# EAGLE design controller6 (EAGLE 7.7.0)

## Sheet 1 of 2
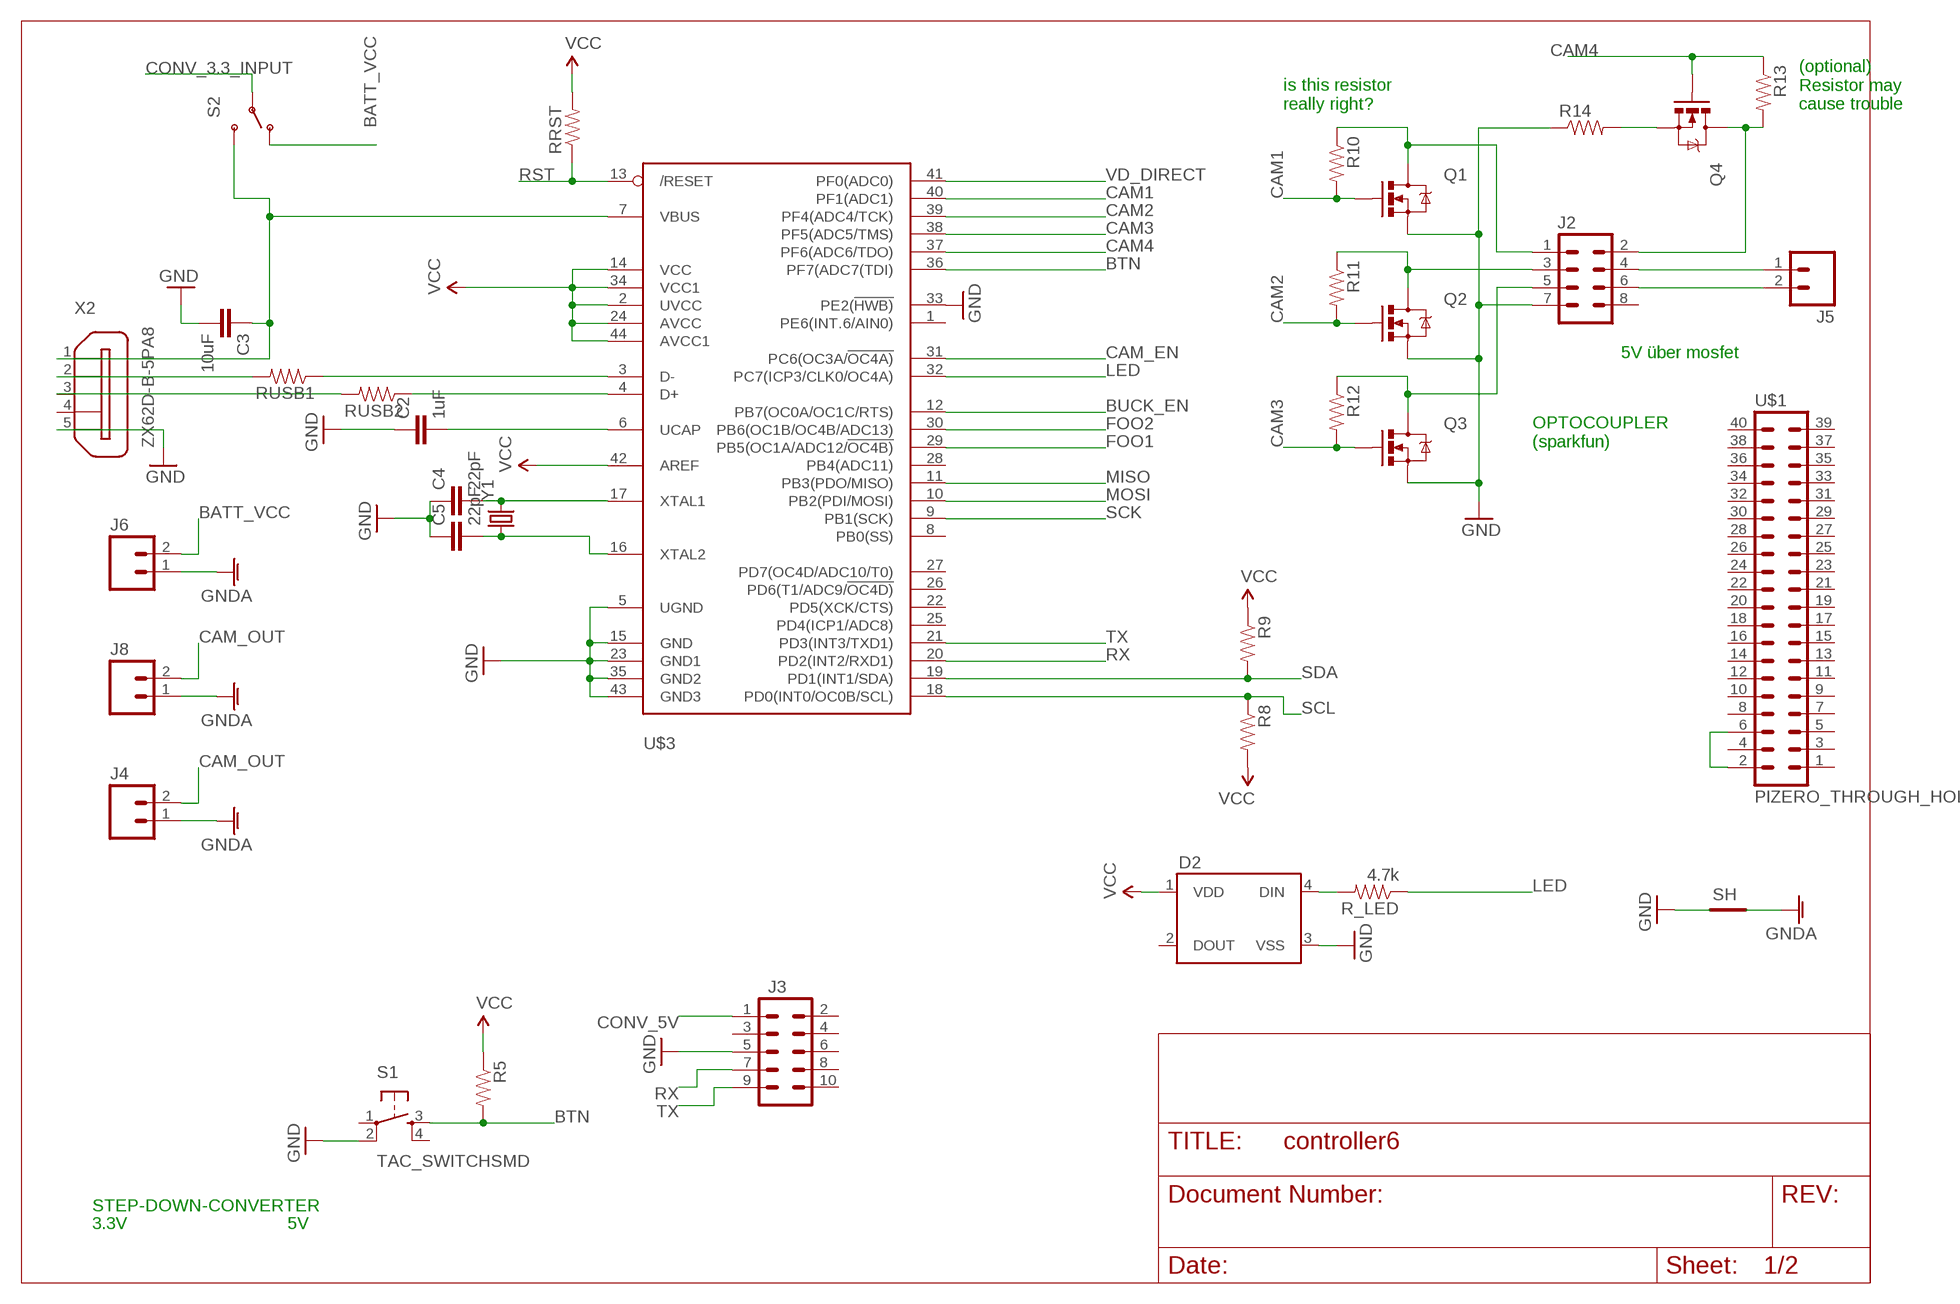
[diagram p0: schematic, sheet 1]

### Parts
C2  1uF  CAP1206  [1206]
C3  10uF  CAP0805  [0805]
C4  22pF  CAP0805  [0805]
C5  22pF  CAP0805  [0805]
D2  WS2812B  [WS2812B]
J2  M04X2  [2X4]
J3  M05X2NO_SILK  [2X5_NOSILK]
J4  M02LOCK  [1X02_LOCK]
J5  M02PTH  [1X02]
J6  M02LOCK  [1X02_LOCK]
J8  M02LOCK  [1X02_LOCK]
Q1  MOSFET-NCHANNELBSS138  [SOT23-3]
Q2  MOSFET-NCHANNELBSS138  [SOT23-3]
Q3  MOSFET-NCHANNELBSS138  [SOT23-3]
Q4  MOSFET-NCHANNELBSS138  [SOT23-3]
R5  RESISTOR0805-RES  [0805]
R8  RESISTOR0805-RES  [0805]
R9  RESISTOR0805-RES  [0805]
R10  RESISTOR0805-RES  [0805]
R11  RESISTOR0805-RES  [0805]
R12  RESISTOR0805-RES  [0805]
R13  RESISTOR0805-RES  [0805]
R14  RESISTOR0805-RES  [0805]
R_LED  4.7k  RESISTOR0805-RES  [0805]
RRST  RESISTOR0805-RES  [0805]
RUSB1  RESISTOR0805-RES  [0805]
RUSB2  RESISTOR0805-RES  [0805]
S1  TAC_SWITCHSMD  [TACTILE-SWITCH-SMD]
S2  SWITCH-SPDTPTH_LOCK  [SWITCH-SPDT_LOCK.007S]
SH  SHORT-HT5  [SHORT_TOP-50]
U$1  PIZERO_THROUGH_HOLE  [PIZERO_THOUGH_HOLE]
U$3  ATMEGA32U4-AU  [TQFP44]
X2  ZX62D-B-5PA8  [ZX62D-B-5PA8]
Y1  CRYSTALCRYSTAL-SMD-5X3-16MHZ  [CRYSTAL-SMD-5X3]

### Nets
BATT_VCC [camera_power]: J6.2 S2.1(O) ; also sheet 2
BTN: R5.2 S1.3 U$3.36(PF7(ADC7(TDI))
BUCK_EN: U$3.12(PB7(OC0A/OC1C/RTS)) ; also sheet 2
CAM1: Q1.1(G) R10.2 U$3.40(PF1(ADC1))
CAM2: Q2.1(G) R11.2 U$3.39(PF4(ADC4/TCK))
CAM3: Q3.1(G) R12.2 U$3.38(PF5(ADC5/TMS))
CAM4: Q4.1(G) R13.1 U$3.37(PF6(ADC6/TDO))
CAM_EN: U$3.31(PC6(OC3A/!OC4A))
CAM_OUT [camera_power]: J4.2 J8.2
CONV_3.3_INPUT [camera_power]: S2.2(P) ; also sheet 2
CONV_5V [power]: J3.1 ; also sheet 2
FOO1: U$3.29(PB5(OC1A/ADC12/!OC4B))
FOO2: U$3.30(PB6(OC1B/OC4B/ADC13))
GND [power]: C2.1 C3.2 C4.1 C5.1 D2.3(VSS) J2.7 J3.5 Q1.2(S) Q2.2(S) Q3.2(S) R14.1 S1.2 SH.1 U$3.5(UGND) U$3.15(GND) U$3.23(GND1) U$3.33(PE2(!HWB)) U$3.35(GND2) U$3.43(GND3) X2.5 ; also sheet 2
GNDA [camera_power]: J4.1 J6.1 J8.1 SH.2
LED: R_LED.1 U$3.32(PC7(ICP3/CLK0/OC4A))
MISO: U$3.11(PB3(PDO/MISO)) ; also sheet 2
MOSI: U$3.10(PB2(PDI/MOSI)) ; also sheet 2
N$1: J2.4 J5.1
N$4: RUSB1.1 U$3.3(D-)
N$5: RUSB2.1 U$3.4(D+)
N$6: J2.6 J5.2
N$7: D2.4(DIN) R_LED.2
N$8: C4.2 U$3.17(XTAL1) Y1.3
N$9: C5.2 U$3.16(XTAL2) Y1.1
N$10: RUSB1.2 X2.2
N$11: RUSB2.2 X2.3
N$16: J2.2 Q4.3(D) R13.2
N$18: Q4.2(S) R14.2
N$19: U$1.2 U$1.6
N$20: C2.2 U$3.6(UCAP)
N$22: C3.1 S2.3(S) U$3.7(VBUS) X2.1
N$31: J2.1 Q1.3(D) R10.1
N$32: J2.3 Q2.3(D) R11.1
N$33: J2.5 Q3.3(D) R12.1
RST: RRST.1 U$3.13(/RESET) ; also sheet 2
RX: J3.7 U$3.20(PD2(INT2/RXD1))
SCK: U$3.9(PB1(SCK)) ; also sheet 2
SCL: R8.1 U$3.18(PD0(INT0/OC0B/SCL)) ; also sheet 2
SDA: R9.2 U$3.19(PD1(INT1/SDA)) ; also sheet 2
TX: J3.9 U$3.21(PD3(INT3/TXD1))
VCC [power]: D2.1(VDD) R5.1 R8.2 R9.1 RRST.2 U$3.2(UVCC) U$3.14(VCC) U$3.24(AVCC) U$3.34(VCC1) U$3.42(AREF) U$3.44(AVCC1) ; also sheet 2
VD_DIRECT: U$3.41(PF0(ADC0)) ; also sheet 2
Unconnected: D2.2(DOUT) J2.8 J3.2 J3.3 J3.4 J3.6 J3.8 J3.10 S1.1 S1.4 U$1.1 U$1.3 U$1.4 U$1.5 U$1.7 U$1.8 U$1.9 U$1.10 U$1.11 U$1.12 U$1.13 U$1.14 U$1.15 U$1.16 U$1.17 U$1.18 U$1.19 U$1.20 U$1.21 U$1.22 U$1.23 U$1.24 U$1.25 U$1.26 U$1.27 U$1.28 U$1.29 U$1.30 U$1.31 U$1.32 U$1.33 U$1.34 U$1.35 U$1.36 U$1.37 U$1.38 U$1.39 U$1.40 U$3.1(PE6(INT.6/AIN0)) U$3.8(PB0(SS)) U$3.22(PD5(XCK/CTS)) U$3.25(PD4(ICP1/ADC8)) U$3.26(PD6(T1/ADC9/!OC4D)) U$3.27(PD7(OC4D/ADC10/T0)) U$3.28(PB4(ADC11)) X2.4 X2.S1 X2.S2 X2.S3 X2.S4

### Notes on the sheet
- is this resistor
  really right?
- (optional)
  Resistor may 
  cause trouble
- 5V über mosfet
- OPTOCOUPLER
  (sparkfun)
- STEP-DOWN-CONVERTER
- 3.3V | 5V

## Sheet 2 of 2
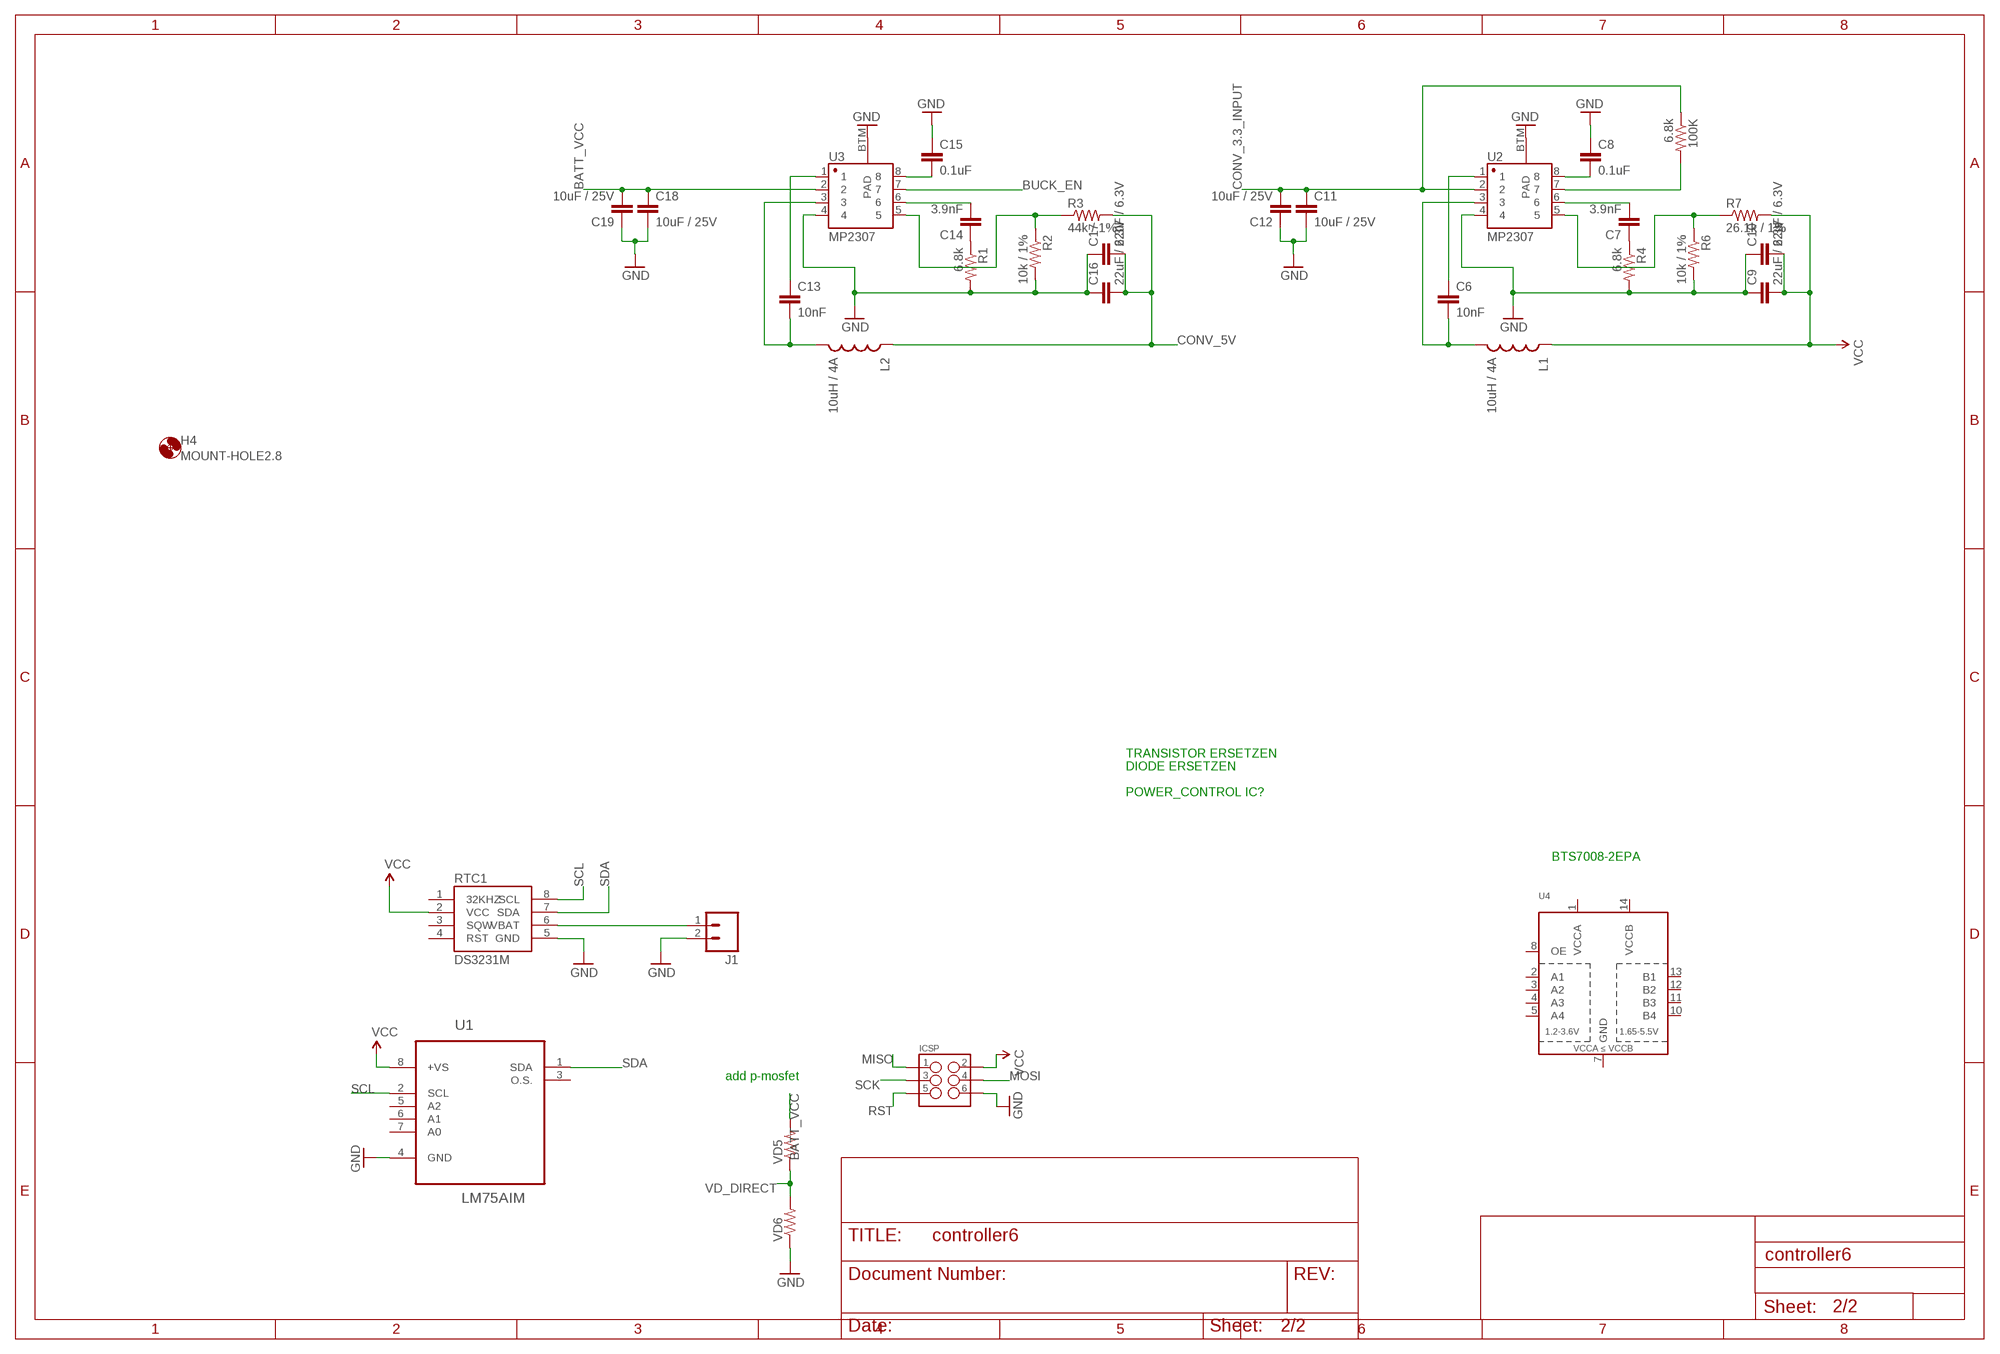
[diagram p1: schematic, sheet 2]

### Parts
100K  6.8k  RESISTOR0805-RES  [0805]
C6  10nF  CAP1206  [1206]
C7  3.9nF  CAP0805  [0805]
C8  0.1uF  CAP0805  [0805]
C9  22uF / 6.3V  CAP1206  [1206]
C10  22uF / 6.3V  CAP1206  [1206]
C11  10uF / 25V  CAP1206  [1206]
C12  10uF / 25V  CAP1206  [1206]
C13  10nF  CAP1206  [1206]
C14  3.9nF  CAP0805  [0805]
C15  0.1uF  CAP0805  [0805]
C16  22uF / 6.3V  CAP1206  [1206]
C17  22uF / 6.3V  CAP1206  [1206]
C18  10uF / 25V  CAP1206  [1206]
C19  10uF / 25V  CAP1206  [1206]
H4  MOUNT-HOLE2.8  [2,8]
ICSP  M03X2FEMALE  [2X3]
J1  M02LOCK_LONGPADS  [1X02_LOCK_LONGPADS]
L1  10uH / 4A  INDUCTORSDR0403-560KL  [SDR0403]
L2  10uH / 4A  INDUCTORSDR0403-560KL  [SDR0403]
R1  6.8k  RESISTOR0805-RES  [0805]
R2  10k / 1%  RESISTOR0805-RES  [0805]
R3  44k / 1%  RESISTOR0805-RES  [0805]
R4  6.8k  RESISTOR0805-RES  [0805]
R6  10k / 1%  RESISTOR0805-RES  [0805]
R7  26.1k / 1%  RESISTOR0805-RES  [0805]
RTC1  DS3231M  [SOIC8]
U1  LM75AIM  [SOIC127P620X175-8N]
U2  MP2307  GENERIC-SOIC8MSGEQ7N-FILTER  [SO08]
U3  MP2307  GENERIC-SOIC8MSGEQ7N-FILTER  [SO08]
U4  TXB0104PWRSOIC14  [SO14]
VD5  RESISTOR1206  [1206]
VD6  RESISTOR1206  [1206]

### Nets
BATT_VCC [camera_power]: C18.1 C19.2 U3.2 VD5.2 ; also sheet 1
BUCK_EN: U3.7 ; also sheet 1
CONV_3.3_INPUT [camera_power]: 100K.1 C11.1 C12.2 U2.2 ; also sheet 1
CONV_5V [power]: C16.2 C17.2 L2.P$1 R3.2 ; also sheet 1
GND [power]: C8.1 C9.1 C10.1 C11.2 C12.1 C15.1 C16.1 C17.1 C18.2 C19.1 ICSP.6 J1.2 R1.2 R2.2 R4.2 R6.2 RTC1.5(GND) U1.4(GND) U2.4 U2.BTM(PAD) U3.4 U3.BTM(PAD) VD6.1 ; also sheet 1
MISO: ICSP.1 ; also sheet 1
MOSI: ICSP.4 ; also sheet 1
N$2: 100K.2 U2.7
N$3: C6.1 U2.1
N$14: C8.2 U2.8
N$17: C6.2 L1.P$2 U2.3
N$21: C7.1 R4.1
N$23: C7.2 U2.6
N$24: R6.1 R7.1 U2.5
N$25: C15.2 U3.8
N$26: C13.2 L2.P$2 U3.3
N$27: C13.1 U3.1
N$28: C14.1 R1.1
N$29: C14.2 U3.6
N$30: R2.1 R3.1 U3.5
RST: ICSP.5 ; also sheet 1
SCK: ICSP.3 ; also sheet 1
SCL: RTC1.8(SCL) U1.2(SCL) ; also sheet 1
SDA: RTC1.7(SDA) U1.1(SDA) ; also sheet 1
VBAT: J1.1 RTC1.6(VBAT)
VCC [power]: C9.2 C10.2 ICSP.2 L1.P$1 R7.2 RTC1.2(VCC) U1.8(+VS) ; also sheet 1
VD_DIRECT: VD5.1 VD6.2 ; also sheet 1
Unconnected: RTC1.1(32KHZ) RTC1.3(SQW) RTC1.4(RST) U1.3(O.S.) U1.5(A2) U1.6(A1) U1.7(A0) U4.1(VCCA) U4.2(A1) U4.3(A2) U4.4(A3) U4.5(A4) U4.7(GND) U4.8(OE) U4.10(B4) U4.11(B3) U4.12(B2) U4.13(B1) U4.14(VCCB)

### Notes on the sheet
- TRANSISTOR ERSETZEN
- DIODE ERSETZEN
- POWER_CONTROL IC?
- BTS7008-2EPA
- add p-mosfet

## Library data of the parts
100K R1-R4 R6 R7 R_LED = SparkFun-Resistors:RESISTOR: Resistor Basic schematic elements and footprints for 0603, 1206, and PTH resistors.
C2 C6-C19 = SparkFun-Capacitors:CAP: Capacitor Standard 0603 ceramic capacitor, and 0.1" leaded capacitor.
C3-C5 = SparkFun-Passives:CAP: Capacitor Standard 0603 ceramic capacitor, and 0.1" leaded capacitor.
D2 = SparkFun-LED:WS2812B: WS2812B - Intelligent control LED integrated light source Technical Specifications: Power Supply Voltage (VDD): 3.5 to 5.3 V Input Voltage (VI): -0.5 to VDD+0.5 V Operating Junction Temperature (Topt): -25°C to +80°C Storage Temperature Range (Tstg): -55°C to +150°C; PROD_ID: DIO-12503
H4 = holes:MOUNT-HOLE: MOUNTING HOLE with drill center marker
ICSP = SparkFun-Connectors:M03X2: 2x3 .1" header. Shrouded, with keying- CONN-10681 SMT- CONN-11415 Pogo pins- HW-11044; PROD_ID: CONN-11566; VALUE: FEMALE 2x3
J1 J4-J6 J8 = SparkFun-Connectors:M02: Standard 2-pin 0.1" header. Use with - straight break away headers ( PRT-00116) - right angle break away headers (PRT-00553) - swiss pins (PRT-00743) - machine pins (PRT-00117) - female headers (PRT-00115) Molex polarized connector foot print use with: PRT-08233 with associated crimp pins and housings. 2.54_SCREWTERM for use with PRT-10571. 3.5mm Screw Terminal footprints for PRT-08084 5mm Screw Terminal footprints for use with PRT-08432
J2 = SparkFun-Connectors:M04X2: .1" header, two rows of four.
J3 = SparkFun-Connectors:M05X2: Header 5x2 Standard 10-pin dual row 0.1" header. Commonly used with AVR-ISP. Use with Spark Fun Electronics SKU: PRT-00778
L1 L2 = SparkFun-Passives:INDUCTOR: Inductors Basic Inductor/Choke - 0603 and 1206. Footprints are not proven and vary greatly between part numbers. INDUCTOR POWER 3.3UH 4.0A SMD 0.197" L x 0.197" W x 0.177" H (5.00mm x 5.00mm x 4.50mm); DIST: DIGIKEY; DIST_ID: SDR0403-560KLCT-ND; VALUE: 56uH
Q1-Q4 = SparkFun-DiscreteSemi:MOSFET-NCHANNEL: Common NMOSFET Parts MFG P/N Store ID Prod ID FDD8780 TRANS-09984 SI7820DN TRANS-11055 FDS6630A IC-08089 2N7002PW TRANS-11151 FQP30N06L COM-10213 TRANS-10060 BSS123LT1G TRANS-08345 BSS138 TRANS-00830 BS170 2N7000; PROD_ID: TRANS-00830; VALUE: 200mA/50V
R5 R8-R14 RRST RUSB1 RUSB2 VD5 VD6 = SparkFun-Passives:RESISTOR: Resistor Basic schematic elements and footprints for 0603, 1206, and PTH resistors.
RTC1 = SparkFun-DigitalIC:DS3231M: DS3231M Real Time Clock. Accuracy +/-5ppm. Battery Backup. 2.3V to 5.5V.; PROD_ID: IC-11985
S1 = SparkFun-Retired:TAC_SWITCH: Momentary Switch Button commonly used for reset or general input. Spark Fun Electronics SKU : COM-00097 SMT- SWCH-08247; PROD_ID: SWCH-08247
S2 = SparkFun-Electromechanical:SWITCH-SPDT: SPDT Switch Simple slide switch, Spark Fun Electronics SKU : COM-00102 DPDT SMT slide switch, AYZ0202, SWCH-08179
SH = shorts-old:SHORT-H: Short between two nets; BOM: no
U1 = NSC_By_element14_Batch_1.1:LM75AIM: Digital Temperature Sensor; MPN: LM75AIM; OC_FARNELL: 1699380; OC_NEWARK: -; PACKAGE: SOIC-8; SUPPLIER: NATIONAL SEMICONDUCTOR
U2 U3 = SparkFun-AnalogIC:GENERIC-SOIC8: A placeholder for generic narrow & wide SOIC8 foorptints - used on the DIP adapter board.; PROD_ID: IC-10141
U4 = SparkFun-DigitalIC:TXB0104PWR: 4-Bit Bi-Directional Level Shifter 1.2V-3.6V (VCCA) to 1.65V-5.5V (VCCB) bi-directional level shifter with auto direction sensing. Max data rate - VCCA 1.8V: 20Mbps (50ns), VCCA 3.3V: 100Mbps (10ns) Digikey: 296-21929-1-ND (TSSOP) IC-11329; PROD_ID: IC-11329
U$1 = pizero:PIZERO_THROUGH_HOLE
U$3 = adafruit:ATMEGA32U4: http://www.ladyada.net/library/eagle
X2 = zx62d-b-5pa8-oshpark_10:ZX62D-B-5PA8: Micro USB Type B Connector - Standard, Shell Through Hole Source: http://www.hirose.co.jp/cataloge_hp/ed_ZX_20140804.pdf; MF: Hirose; MPN: ZX62D-B-5PA8; OC_FARNELL: 2300438; OC_NEWARK: 69W0712
Y1 = SparkFun-FreqCtrl:CRYSTAL: Various standard crystals. Proven footprints.; PROD_ID: XTAL-08218

## Net classes
0 default: width 0.254 mm, clearance 0.254 mm
1 power: width 0.305 mm, clearance 0.254 mm
2 camera_power: width 0.508 mm, clearance 0.254 mm
3 usbsignal: width 0.305 mm, clearance 0.254 mm

## Board
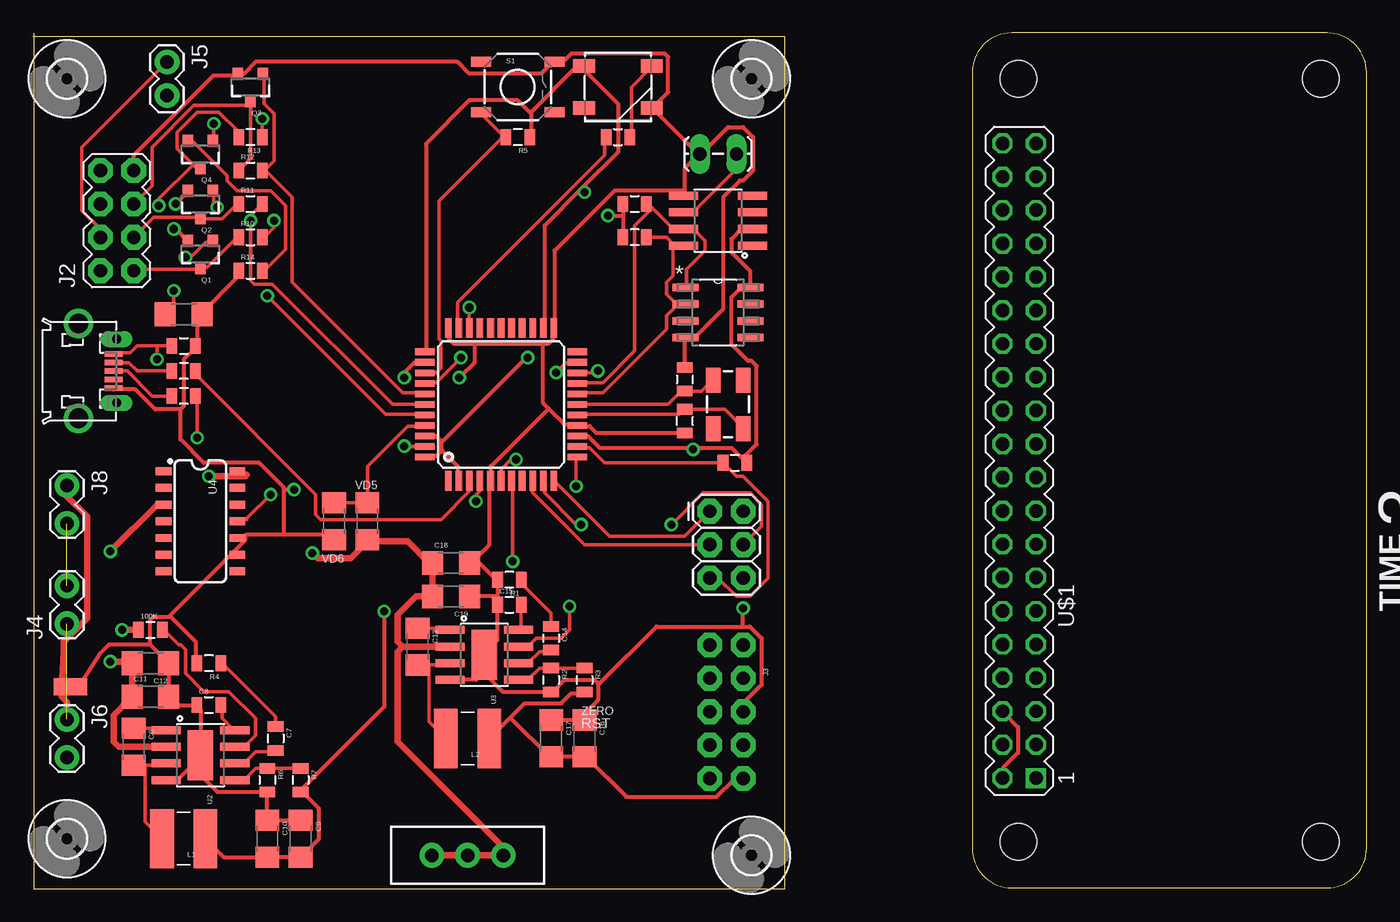
[diagram p2: board, top side]
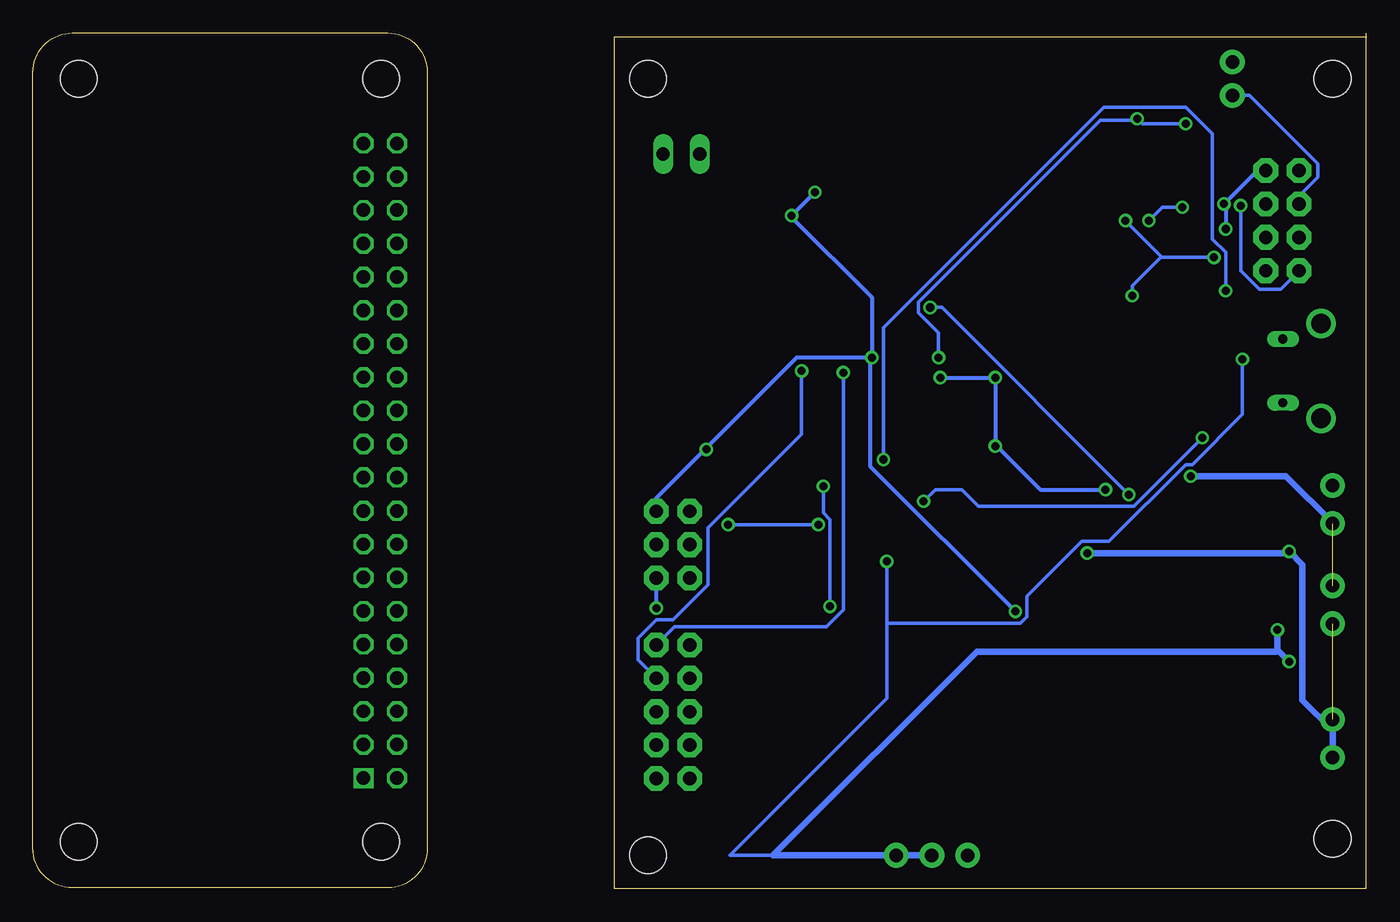
[diagram p3: board, bottom side, seen from below]

Size 101.45 x 65.08 mm. Coordinates in mm from the lower left corner, seen from the top.
Outline: 0,64.77 57.2,64.77 57.2,0.01 0.05,0 0.05,65.03
Copper layers (1*16): Top 0.035mm / dielectric 1.5mm / Bottom 0.035mm
Design rules "default": minimum track width 10mil, minimum drill 24mil, track to track 8mil, track to pad 8mil, pad to pad 8mil, via to via 8mil, smd to smd 8mil, copper to edge 40mil, drill to drill 8mil, minimum pad ring 10mil, minimum via ring 8mil, stop-mask expansion 4mil, vias tented up to drill 0mil, thermal gap 10mil

### Footprints (pad centres in the part's own frame; a part is rotated, then mirrored left to right if it is on the bottom)
0805 = smd 0.8 x 1.2: 1 -0.9,0; 2 0.9,0
1206 = smd 1.6 x 1.8: 1 -1.4,0; 2 1.4,0
WS2812B = smd 1.651 x 1: 1 -2.577,1.6; 2 -2.577,-1.6; 3 2.577,-1.6; 4 2.577,1.6
2,8 = hole 2.8: 0,0
2X3 = drill 1.016 pad 1.88 octagon: 1 0,0; 2 0,2.54; 3 2.54,0; 4 2.54,2.54; 5 5.08,0; 6 5.08,2.54
1X02_LOCK_LONGPADS = drill 1.016 long: 1 -0.127,0; 2 2.667,0
2X4 = drill 1.016 pad 1.88 octagon: 1 -3.81,-1.27; 2 -3.81,1.27; 3 -1.27,-1.27; 4 -1.27,1.27; 5 1.27,-1.27; 6 1.27,1.27; 7 3.81,-1.27; 8 3.81,1.27
2X5_NOSILK = drill 1.016 pad 1.88 octagon: 1 -1.27,5.08; 2 1.27,5.08; 3 -1.27,2.54; 4 1.27,2.54; 5 -1.27,0; 6 1.27,0; 7 -1.27,-2.54; 8 1.27,-2.54; 9 -1.27,-5.08; 10 1.27,-5.08
1X02_LOCK = drill 1.016 pad 1.88: 1 -0.178,0; 2 2.718,0
1X02 = drill 1.016 pad 1.88: 1 0,0; 2 2.54,0
SDR0403 = smd 1.8 x 4.5: P$1 -1.65,0; P$2 1.65,0
SOT23-3 = smd 0.8 x 0.9: 1 -0.95,-1; 2 0.95,-1; 3 0,1.1
SOIC8 = smd 0.61 x 2.21: 1 -1.905,-2.616; 2 -0.635,-2.616; 3 0.635,-2.616; 4 1.905,-2.616; 5 1.905,2.616; 6 0.635,2.616; 7 -0.635,2.616; 8 -1.905,2.616
TACTILE-SWITCH-SMD = smd 1.524 x 0.762: 1 -2.794,1.905; 2 2.794,1.905; 3 -2.794,-1.905; 4 2.794,-1.905
SWITCH-SPDT_LOCK.007S = drill 1.016 pad 1.88: 1 0,2.718; 2 0,0; 3 0,-2.718
SHORT_TOP-50 = smd 1.27 x 1.27: 1 0.635,0; 2 -0.635,0
SOIC127P620X175-8N = smd 1.981 x 0.559: 1 -2.464,1.905; 2 -2.464,0.635; 3 -2.464,-0.635; 4 -2.464,-1.905; 5 2.464,-1.905; 6 2.464,-0.635; 7 2.464,0.635; 8 2.464,1.905
SO08 = smd 0.61 x 2.21: 1 -1.905,-2.616; 2 -0.635,-2.616; 3 0.635,-2.616; 4 1.905,-2.616; 5 1.905,2.616; 6 0.635,2.616; 7 -0.635,2.616; 8 -1.905,2.616 | smd 3.81 x 1.93: BTM 0,0
SO14 = smd 0.6 x 1.2: 1 -3.81,-2.8; 2 -2.54,-2.8; 3 -1.27,-2.8; 4 0,-2.8; 5 1.27,-2.8; 6 2.54,-2.8; 7 3.81,-2.8; 8 3.81,2.8; 9 2.54,2.8; 10 1.27,2.8; 11 0,2.8; 12 -1.27,2.8; 13 -2.54,2.8; 14 -3.81,2.8
PIZERO_THOUGH_HOLE = drill 1.016 square: 1 8.34,25.15 | drill 1.016 octagon: 2 8.34,27.69; 3 10.88,25.15; 4 10.88,27.69; 5 13.42,25.15; 6 13.42,27.69; 7 15.96,25.15; 8 15.96,27.69; 9 18.5,25.15; 10 18.5,27.69; 11 21.04,25.15; 12 21.04,27.69; 13 23.58,25.15; 14 23.58,27.69; 15 26.12,25.15; 16 26.12,27.69; 17 28.66,25.15; 18 28.66,27.69; 19 31.2,25.15; 20 31.2,27.69; 21 33.74,25.15; 22 33.74,27.69; 23 36.28,25.15; 24 36.28,27.69; 25 38.82,25.15; 26 38.82,27.69; 27 41.36,25.15; 28 41.36,27.69; 29 43.9,25.15; 30 43.9,27.69; 31 46.44,25.15; 32 46.44,27.69; 33 48.98,25.15; 34 48.98,27.69; 35 51.52,25.15; 36 51.52,27.69; 37 54.06,25.15; 38 54.06,27.69; 39 56.6,25.15; 40 56.6,27.69 | hole 2.8: 3.5,3.5; 3.5,26.5; 61.5,26.5; 61.5,3.5
TQFP44 = smd 1.5 x 0.5: 1 -5.8,4; 2 -5.8,3.2; 3 -5.8,2.4; 4 -5.8,1.6; 5 -5.8,0.8; 6 -5.8,0; 7 -5.8,-0.8; 8 -5.8,-1.6; 9 -5.8,-2.4; 10 -5.8,-3.2; 11 -5.8,-4; 23 5.8,-4; 24 5.8,-3.2; 25 5.8,-2.4; 26 5.8,-1.6; 27 5.8,-0.8; 28 5.8,0; 29 5.8,0.8; 30 5.8,1.6; 31 5.8,2.4; 32 5.8,3.2; 33 5.8,4 | smd 0.5 x 1.5: 12 -4,-5.8; 13 -3.2,-5.8; 14 -2.4,-5.8; 15 -1.6,-5.8; 16 -0.8,-5.8; 17 0,-5.8; 18 0.8,-5.8; 19 1.6,-5.8; 20 2.4,-5.8; 21 3.2,-5.8; 22 4,-5.8; 34 4,5.8; 35 3.2,5.8; 36 2.4,5.8; 37 1.6,5.8; 38 0.8,5.8; 39 0,5.8; 40 -0.8,5.8; 41 -1.6,5.8; 42 -2.4,5.8; 43 -3.2,5.8; 44 -4,5.8
ZX62D-B-5PA8 = smd 1.35 x 0.4: 1 4.825,1.3; 2 4.825,0.65; 3 4.825,0; 4 4.825,-0.65; 5 4.825,-1.3 | drill 1.5: S1 2.15,-3.6; S2 2.15,3.6 | drill 0.7 long: S3 5.05,2.425; S4 5.05,-2.425
CRYSTAL-SMD-5X3 = smd 1.9 x 1.1: 1 -1.85,-1.15; 2 1.85,-1.15; 3 1.85,1.15; 4 -1.85,1.15

### Placement (x,y rotation side)
100K  8.94,19.68 0 top
C2  11.48,43.69 180 top
C3  11.48,41.27 0 top
C4  49.58,38.73 270 top
C5  49.58,35.56 90 top
C6  7.67,10.79 270 top
C7  18.47,11.43 270 top
C8  13.39,13.97 0 top
C9  20.37,3.81 270 top
C10  17.83,3.81 270 top
C11  8.94,14.61 0 top
C12  8.94,17.14 180 top
C13  29.26,18.41 270 top
C14  39.42,19.05 270 top
C15  36.25,21.59 0 top
C16  41.96,11.43 270 top
C17  39.42,11.43 270 top
C18  31.8,24.77 0 top
C19  31.8,22.23 180 top
D2  44.5,60.96 0 top
H1  MOUNT-HOLE2.8  [2,8]  2.59,3.81 180 top
H2  MOUNT-HOLE2.8  [2,8]  2.59,61.59 180 top
H3  MOUNT-HOLE2.8  [2,8]  54.66,61.59 180 top
H4  54.66,2.54 180 top
ICSP  51.49,28.7 270 top
J1  53.39,55.88 180 top
J2  6.4,50.8 90 top
J3  52.76,13.46 180 top
J4  2.59,20.32 90 top
J5  10.21,62.87 270 top
J6  2.59,12.7 270 top
J8  2.59,30.48 270 top
L1  11.48,3.81 180 top
L2  33.07,11.43 180 top
Q1  12.75,48.26 180 top
Q2  12.75,52.07 180 top
Q3  16.56,60.96 180 top
Q4  12.75,55.88 180 top
R1  36.25,23.5 180 top
R2  39.42,15.88 270 top
R3  41.96,15.88 270 top
R4  13.39,17.14 180 top
R5  36.88,57.15 180 top
R6  17.83,8.26 270 top
R7  20.37,8.26 270 top
R8  45.77,49.53 180 top
R9  45.77,52.07 0 top
R10  16.56,49.53 0 top
R11  16.56,52.07 0 top
R12  16.56,54.61 0 top
R13  16.56,57.15 180 top
R14  16.56,46.99 0 top
R_LED  44.5,57.15 0 top
RRST  53.39,32.38 0 top
RTC1  52.12,50.8 90 top
RUSB1  11.48,39.37 180 top
RUSB2  11.48,37.47 180 top
S1  36.88,60.96 0 top
S2  33.07,2.54 90 top
SH  2.85,15.37 0 top
U1  52.12,43.81 0 top
U2  12.75,10.16 270 top
U3  34.34,17.78 270 top
U4  12.75,27.94 270 top
U$1  101.45,0.08 90 top
U$3  35.61,36.83 90 top
VD5  25.45,27.94 270 top
VD6  22.91,27.94 90 top
X2  1.32,39.37 0 top
Y1  52.88,36.83 90 top

### Tracks (layer width: path | path; a pad name or v marks a point on that pad's centre or on a via)
BATT_VCC  (via drill 0.61)
  Top 0.508: v5.89,25.65 9.45,29.21 9.55,29.21 | 28.12,18.41 U3.2 | 28.12,18.41 27.74,18.8 27.74,20.83 29.13,22.23 C19.2 C18.1 30.15,24.77 28.5,26.42 25.45,26.42 VD5.2 25.32,26.29 24.18,25.15 21.64,25.15 v21.26,25.53 | S2.1 36.37,2.54 27.74,11.18 27.74,18.03 28.12,18.41
  Bottom 0.508: J6.2 2.59,12.06 4.88,14.35 4.88,24.64 v5.89,25.65 6.02,25.53 v21.26,25.53
BTN
  Top 0.254: S1.3 34.09,58.93 35.87,57.15 R5.2 35.74,57.15 30.91,52.32 30.91,41.78 31.04,41.66 31.04,39.62 30.66,39.24 29.9,39.24 U$3.36
BUCK_EN  (via drill 0.61)
  Top 0.254: v41.33,30.61 41.33,32.77 U$3.12 | v40.82,21.46 40.82,19.68 40.18,19.05 38.28,19.05 37.64,18.41 U3.7
  Bottom 0.254: v41.33,30.61 41.33,28.57 40.82,28.07 v40.82,21.46
CAM1  (via drill 0.61)
  Top 0.254: v11.61,48.01 11.99,48.01 13.13,49.15 13.64,49.15 Q1.1 | v18.34,50.8 18.34,50.29 17.58,49.53 R10.2 | v17.83,45.09 26.85,36.07 29.77,36.07 U$3.40
  Bottom 0.254: v11.61,48.01 15.54,48.01 15.61,48.07 | v18.34,50.8 15.61,48.07 | v17.83,45.09 17.83,45.85 15.61,48.07
CAM2  (via drill 0.61)
  Top 0.254: v14.02,51.82 13.77,52.07 13.77,52.96 Q2.1 | R11.2 16.56,51.18 v16.56,50.8 16.56,46.23 16.81,45.97 18.21,45.97 27.36,36.83 U$3.39
  Bottom 0.254: v14.02,51.82 15.54,51.82 v16.56,50.8
CAM3
  Top 0.254: Q3.1 17.58,61.85 17.58,59.69 18.34,58.93 18.34,55.37 17.58,54.61 R12.2 17.7,54.61 19.74,52.58 19.74,46.1 28.12,37.72 29.77,37.72 U$3.38
CAM4  (via drill 0.61)
  Top 0.254: v13.77,58.17 13.77,56.9 Q4.1 | v17.45,58.55 R13.1 | v32.56,40.39 30.66,38.48 29.9,38.48 U$3.37
  Bottom 0.254: v13.77,58.17 17.07,58.17 v17.45,58.55 17.45,58.42 20.24,58.42 34.09,44.58 34.09,43.81 32.56,42.29 v32.56,40.39
CAM_EN  (via drill 0.61)
  Top 0.254: v33.2,44.2 33.2,42.67 U$3.31 | v18.08,29.97 16.31,28.19 16.26,28.07
  Bottom 0.254: v33.2,44.2 32.31,44.2 v18.08,29.97
CAM_OUT  (via drill 0.61)  (1 unrouted)
  Top 0.508: v13.39,31.37 16.18,31.37 16.26,31.49
  Bottom 0.508: v13.39,31.37 6.15,31.37 2.59,27.81 J8.2
CONV_3.3_INPUT  (via drill 0.61)
  Top 0.508: v6.78,19.68 100K.1 | v5.89,17.27 7.29,17.27 7.42,17.14 C12.2 7.54,17.02 C11.1 7.42,14.48 6.15,13.21 6.15,11.18 6.53,10.79 U2.2
  Bottom 0.508: 6.78,18.16 v6.78,19.68 | v5.89,17.27 6.78,18.16 | S2.2 45.14,2.54 29.64,18.03 6.91,18.03 6.78,18.16
CONV_5V
  Top 0.305: 36.31,13.02 L2.P$1 | 36.31,13.02 37.39,14.1 40.18,14.1 40.95,14.86 41.96,14.86 R3.2 | 36.31,13.02 39.29,10.03 C17.2 C16.2 42.09,10.03 45.14,6.99 51.99,6.99 53.39,8.38 J3.1
GND  (via drill 0.61)
  Top 0.305: R14.1 15.54,46.99 15.54,46.48 12.88,43.81 C2.1 12.5,43.31 12.5,41.27 C3.2 12.37,41.15 11.48,40.26 11.48,36.7 11.23,36.45 | 11.23,36.45 9.32,36.45 7.8,37.97 6.15,37.97 X2.5 | C9.1 17.96,5.21 C10.1 R6.2 17.7,7.37 14.02,7.37 12.12,9.27 U2.BTM | U2.4 10.97,8.26 12.75,10.03 U2.BTM | 19.1,26.92 22.53,26.92 VD6.1 | 19.1,26.92 16.31,26.92 16.26,26.93 16.18,26.8 16.18,26.54 10.46,20.83 10.46,20.7 | 10.46,20.7 12.37,18.8 12.37,17.14 R4.2 | 10.46,20.7 9.2,20.7 8.94,20.45 8.94,18.54 | 8.94,18.54 C12.1 10.34,17.02 10.34,14.73 C11.2 10.46,14.61 11.1,13.97 C8.1 12.5,13.84 12.75,13.59 U2.BTM | SH.1 5.13,17.91 5.77,18.54 8.94,18.54 | 11.23,36.45 11.23,34.16 13.01,32.38 17.2,32.38 19.1,30.48 19.1,30.35 | 19.1,26.92 19.1,30.35 | C5.1 42.85,34.67 42.34,35.18 41.45,35.18 U$3.15 41.33,35.31 40.44,35.31 39.23,36.51 | v28.24,33.66 29.77,33.66 U$3.43 | v28.24,38.86 28.24,39.24 29.01,40.01 29.77,40.01 U$3.35 | 38.79,41.4 39.17,41.4 39.55,41.78 39.55,42.55 U$3.23 39.68,42.67 39.68,48.51 44.25,53.09 49.58,53.09 | 38.79,41.4 33.58,41.4 | 33.58,41.4 32.05,41.4 31.67,41.78 31.67,42.55 U$3.33 | v32.44,38.86 33.58,40.01 33.58,41.4 | 39.23,36.51 38.79,36.96 38.79,41.4 | 35.36,22.23 R1.2 35.23,23.5 33.71,25.02 C18.2 33.33,24.77 34.72,26.16 34.72,30.99 U$3.5 34.85,31.11 34.85,32.13 39.23,36.51 | 35.36,22.23 C15.1 35.36,21.46 35.36,18.92 34.34,17.91 U3.BTM | 35.36,22.23 C19.1 | C17.1 C16.1 41.96,13.34 42.98,14.35 42.98,15.62 | U3.BTM 34.34,16.38 35.74,14.99 39.42,14.99 R2.2 39.55,14.99 40.44,15.88 42.72,15.88 42.98,15.62 | U3.4 33.71,15.88 34.21,16.38 U3.BTM | J3.5 54.03,14.1 55.42,15.49 55.42,19.05 54.53,19.94 54.03,19.94
  Top 0.305: 54.03,19.94 47.42,19.94 43.1,15.62 42.98,15.62 | 54.03,19.94 v54.03,21.34 | v10.72,50.16 10.85,50.16 11.73,49.28 Q1.2 | v10.85,52.07 11.73,52.96 Q2.2 | J2.7 7.67,55.75 13.77,61.85 15.54,61.85 Q3.2 15.67,61.98 16.05,61.98 16.94,62.87 32.31,62.87 33.2,61.98 38.66,61.98 39.55,62.87 S1.2 40.31,62.87 40.95,63.5 48.06,63.5 48.31,63.25 48.31,60.58 47.17,59.44 D2.3 47.17,59.31 50.6,55.88 J1.2 | C4.1 49.58,41.91 U1.4 49.71,42.04 50.47,42.04 52.5,44.07 52.5,52.58 53.77,53.85 54.03,53.85 54.79,54.61 54.79,57.15 54.03,57.91 52.88,57.91 50.85,55.88 J1.2 | 49.58,53.09 49.58,54.74 J1.2 | 49.58,53.09 49.58,52.7 RTC1.5 | v19.86,30.35 19.1,30.35
  Bottom 0.305: v32.44,38.86 v28.24,38.86 v28.24,33.66 28.12,33.66 24.82,30.35 v19.86,30.35 | v54.03,21.34 ICSP.6 | 10.72,52.07 10.72,52.2 8.31,54.61 J2.7 | 10.72,52.07 v10.72,50.16 | v10.85,52.07 10.72,52.07
GNDA  (1 unrouted)
  Top 0.508: J6.1 2.59,14.22 2.21,14.61 SH.2 2.34,18.03 2.34,18.8 4.12,20.57 4.12,28.32 2.59,29.84 J8.1
LED
  Top 0.254: R_LED.1 43.48,57.15 43.48,55.75 32.31,44.58 32.31,42.67 U$3.32
MISO
  Top 0.254: ICSP.1 49.58,26.8 43.87,26.8 39.68,30.99 U$3.11
MOSI  (via drill 0.61)
  Top 0.254: v41.71,27.69 41.33,27.69 38.91,30.1 38.91,30.99 U$3.10 | v48.57,27.69 50.98,30.1 54.53,30.1 55.42,29.21 55.42,27.56 ICSP.4
  Bottom 0.254: v48.57,27.69 v41.71,27.69
N$1
  Top 0.254: J2.4 5.13,50.16 3.73,51.56 3.73,56.39 J5.1
N$2
  Top 0.254: U2.7 16.05,10.79 16.94,11.68 16.94,12.95 14.91,14.99 13.01,14.99 11.61,16.38 11.61,18.16 11.23,18.54 11.1,18.54 9.96,19.68 100K.2
N$3
  Top 0.254: C6.1 9.96,12.19 10.08,12.06 U2.1
N$4
  Top 0.254: RUSB1.1 12.5,39.37 12.5,38.99 21.51,29.97 21.51,28.45 21.89,28.07 31.04,28.07 33.2,30.23 33.2,30.99 U$3.3
N$5  (via drill 0.61)
  Top 0.254: v12.5,34.29 12.5,37.47 RUSB2.1 | v33.71,29.46 33.71,29.97 33.96,30.23 33.96,30.99 U$3.4
  Bottom 0.254: v12.5,34.29 17.7,29.08 29.51,29.08 30.79,30.35 32.82,30.35 v33.71,29.46
N$6
  Bottom 0.254: J2.6 5.13,52.7 3.73,54.1 3.73,55.12 8.94,60.33 J5.2
N$7
  Top 0.254: R_LED.2 45.52,57.15 45.52,60.96 47.04,62.48 D2.4
N$8
  Top 0.254: Y1.3 51.61,38.61 50.85,37.85 C4.2 49.58,37.72 49.2,37.72 48.31,36.83 U$3.17
N$9
  Top 0.254: 49.58,36.45 52.63,36.45 54.03,35.05 Y1.1 | 49.58,36.45 49.2,36.07 41.45,36.07 U$3.16 | 49.58,36.45 C5.2
N$10
  Top 0.254: RUSB1.2 7.92,39.37 7.29,40.01 6.15,40.01 X2.2
N$11
  Top 0.254: RUSB2.2 9.07,37.47 7.16,39.37 X2.3
N$14
  Top 0.254: C8.2 14.4,13.97 14.4,12.95 15.29,12.06 U2.8
N$16  (via drill 0.61)
  Top 0.254: 12.18,55.05 10.97,56.26 10.97,57.53 12.5,59.05 14.15,59.05 15.54,57.66 15.54,57.15 R13.2 | 12.18,55.05 12.37,54.86 12.75,54.86 Q4.3 | 12.18,55.05 9.58,52.45 v9.58,51.94
  Bottom 0.254: v9.58,51.94 9.58,46.99 8.18,45.59 6.53,45.59 J2.2
N$17
  Top 0.254: 8.56,9.4 9.96,9.4 10.08,9.53 U2.3 | 8.56,9.4 C6.2 8.56,9.4 | 8.56,9.4 8.56,5.08 L1.P$2
N$18
  Top 0.254: Q4.2 11.86,56.77 12.24,56.77 14.78,54.23 14.78,53.85 15.54,53.09 18.08,53.09 19.23,51.94 19.23,48.64 17.58,46.99 R14.2
N$19
  Top 0.305: U$1.2 73.81,8.52 73.81,9.22 74.93,10.34 74.93,12.29 73.81,13.41 U$1.6
N$20  (via drill 0.61)
  Top 0.254: U$3.6 35.61,31.88 36.37,32.64 v36.75,32.64 | v10.72,45.47 10.72,44.32 C2.2
  Bottom 0.254: v36.75,32.64 36.75,42.67 19.99,59.44 13.77,59.44 11.73,57.4 11.73,49.4 10.72,48.39 v10.72,45.47
N$21
  Top 0.254: C7.1 18.47,13.08 14.4,17.14 R4.1
N$22  (via drill 0.61)
  Top 0.254: 9.45,41.27 7.92,41.27 7.42,40.77 6.15,40.77 X2.1 | 9.45,41.27 C3.1 | v36.5,24.89 36.5,30.99 U$3.7 | v9.45,40.26 9.45,41.27
  Bottom 0.254: 36.5,20.19 36.5,14.48 48.44,2.54 S2.3 | 36.5,20.19 v36.5,24.89 | v9.45,40.26 9.45,36.07 13.26,32.26 13.77,32.26 19.61,26.42 21.64,26.42 25.83,22.23 25.83,20.7 26.34,20.19 36.5,20.19
N$23
  Top 0.254: U2.6 16.05,9.53 16.94,10.41 18.47,10.41 C7.2
N$24
  Top 0.254: 17.83,9.14 20.37,9.14 R7.1 | 17.83,9.14 16.94,9.14 16.05,8.26 U2.5 | 17.83,9.14 R6.1
N$25
  Top 0.254: C15.2 37.14,19.81 37.01,19.68 U3.8
N$26
  Top 0.254: 30.15,17.02 31.55,17.02 31.67,17.14 U3.3 | 30.15,17.02 C13.2 30.15,17.02 | 30.15,17.02 30.15,12.7 L2.P$2
N$27
  Top 0.254: C13.1 31.55,19.81 31.67,19.68 U3.1
N$28
  Top 0.254: C14.1 39.42,20.95 37.26,23.11 37.26,23.5 R1.1
N$29
  Top 0.254: U3.6 37.64,17.14 38.53,18.03 39.42,18.03 C14.2
N$30
  Top 0.254: R2.1 R3.1 | R2.1 38.53,16.76 37.64,15.88 U3.5 | R2.1
N$31
  Top 0.254: R10.1 15.54,49.53 13.26,47.24 12.75,47.24 Q1.3 12.75,47.12 7.8,47.12 J2.1
N$32
  Top 0.254: R11.1 15.54,52.07 14.4,50.93 12.75,50.93 Q2.3 12.75,51.05 9.2,51.05 J2.3
N$33
  Top 0.254: 16.56,59.56 16.56,55.5 15.67,54.61 R12.1 | 16.56,59.56 Q3.3 16.56,59.82 | 16.56,59.56 12.24,59.56 9.07,56.39 9.07,53.47 J2.5
RST
  Top 0.254: U$3.13 41.45,33.53 42.34,33.53 43.48,32.38 RRST.1 52.5,32.38 53.52,31.37 54.03,31.37 55.93,29.46 55.93,23.62 54.53,22.23 53.52,22.23 52.12,23.62 ICSP.5
RX  (via drill 0.61)
  Top 0.254: v42.98,39.37 42.85,39.24 41.45,39.24 U$3.20
  Bottom 0.254: v42.98,39.37 42.98,34.54 50.09,27.43 50.09,23.11 52.76,20.45 54.03,20.45 55.42,19.05 55.42,17.4 J3.7
SCK
  Top 0.254: ICSP.3 41.96,26.16 38.02,30.1 38.02,30.99 U$3.9
SCL
  Top 0.254: R8.1 48.18,49.53 48.82,48.9 RTC1.8 48.69,48.9 48.69,46.61 48.18,46.1 48.18,45.21 48.95,44.45 U1.2 49.07,44.45 48.18,43.56 48.18,42.55 43.36,37.72 41.45,37.72 U$3.18
SDA
  Top 0.254: U$3.19 41.45,38.48 43.36,38.48 45.77,40.89 45.77,50.42 47.04,51.69 R9.2 46.79,52.07 48.69,50.16 RTC1.7 50.22,50.16 51.11,49.28 51.11,48.51 49.71,47.12 49.71,45.72 U1.1
TX  (via drill 0.61)
  Top 0.254: v39.8,39.24 40.56,40.01 41.33,40.01 U$3.21
  Bottom 0.254: v39.8,39.24 39.8,21.21 41.07,19.94 52.63,19.94 J3.9
VBAT
  Top 0.254: RTC1.6 50.22,51.44 53.52,54.74 J1.1
VCC  (via drill 0.61)
  Top 0.305: RTC1.2 53.9,50.16 53.14,49.4 53.14,48.39 54.53,46.99 54.53,45.72 U1.8 53.9,45.72 53.14,44.96 53.14,41.4 54.41,40.13 54.66,40.13 55.04,39.75 55.04,33.78 54.03,32.77 RRST.2 54.28,32.38 53.14,33.53 50.22,33.53 | 50.22,33.53 43.1,33.53 42.22,34.42 41.45,34.42 U$3.14 | L1.P$1 14.53,2.41 17.7,2.41 C10.2 20.24,2.41 C9.2 21.77,3.81 21.77,6.1 20.62,7.24 20.37,7.24 R7.2 20.37,7.49 26.72,13.84 v26.72,21.08 | 31.04,33.27 30.66,32.89 29.9,32.89 U$3.44 | 31.04,34.04 31.04,33.27 | 31.04,34.04 30.66,34.42 29.9,34.42 U$3.42 | U$3.2 32.31,31.11 32.31,32.13 31.17,33.27 31.04,33.27 | 44.88,51.18 44.88,52.07 R9.1 | 44.88,51.18 44.88,49.53 R8.2 | 37.9,59.05 37.9,57.15 R5.1 | 37.9,59.05 41.33,62.48 41.83,62.48 D2.1 41.83,62.36 44.5,59.69 44.5,56.01 41.71,53.21 | U$3.34 29.9,40.89 29.9,56.64 33.2,59.94 36.88,59.94 37.77,59.05 37.9,59.05 | 41.71,53.21 38.91,50.42 38.91,42.67 U$3.24 | v43.74,51.18 44.88,51.18 | 41.71,53.21 v41.96,52.96 | v37.64,40.39 37.52,40.39 31.17,34.04 31.04,34.04 | v50.22,33.4 50.22,33.53
  Bottom 0.305: v41.96,52.96 v43.74,51.18 43.74,51.05 37.64,44.96 v37.64,40.39 | ICSP.2 54.03,29.72 50.28,33.47 | 50.28,33.47 43.36,40.39 v37.64,40.39 | v26.72,21.08 37.77,32.13 37.77,40.26 v37.64,40.39 | v50.22,33.4 50.28,33.47
VD_DIRECT
  Top 0.254: U$3.41 29.77,35.18 28.5,35.18 25.45,32.13 VD5.1 VD6.2

### Text on the board
tPlace: compressed | time.de | 3 | TIME | BOX | ZERO | RST